# Altium schematic sheet scheme.SchDoc
size A2; FORM_Developer: Фамилия; FORM_Name: Название; FORM_Des: Обозначение; FORM_Ctrl: Фамилия; FORM_Tctrl: Фамилия; FORM_Nctrl: Фамилия; FORM_State: Фамилия
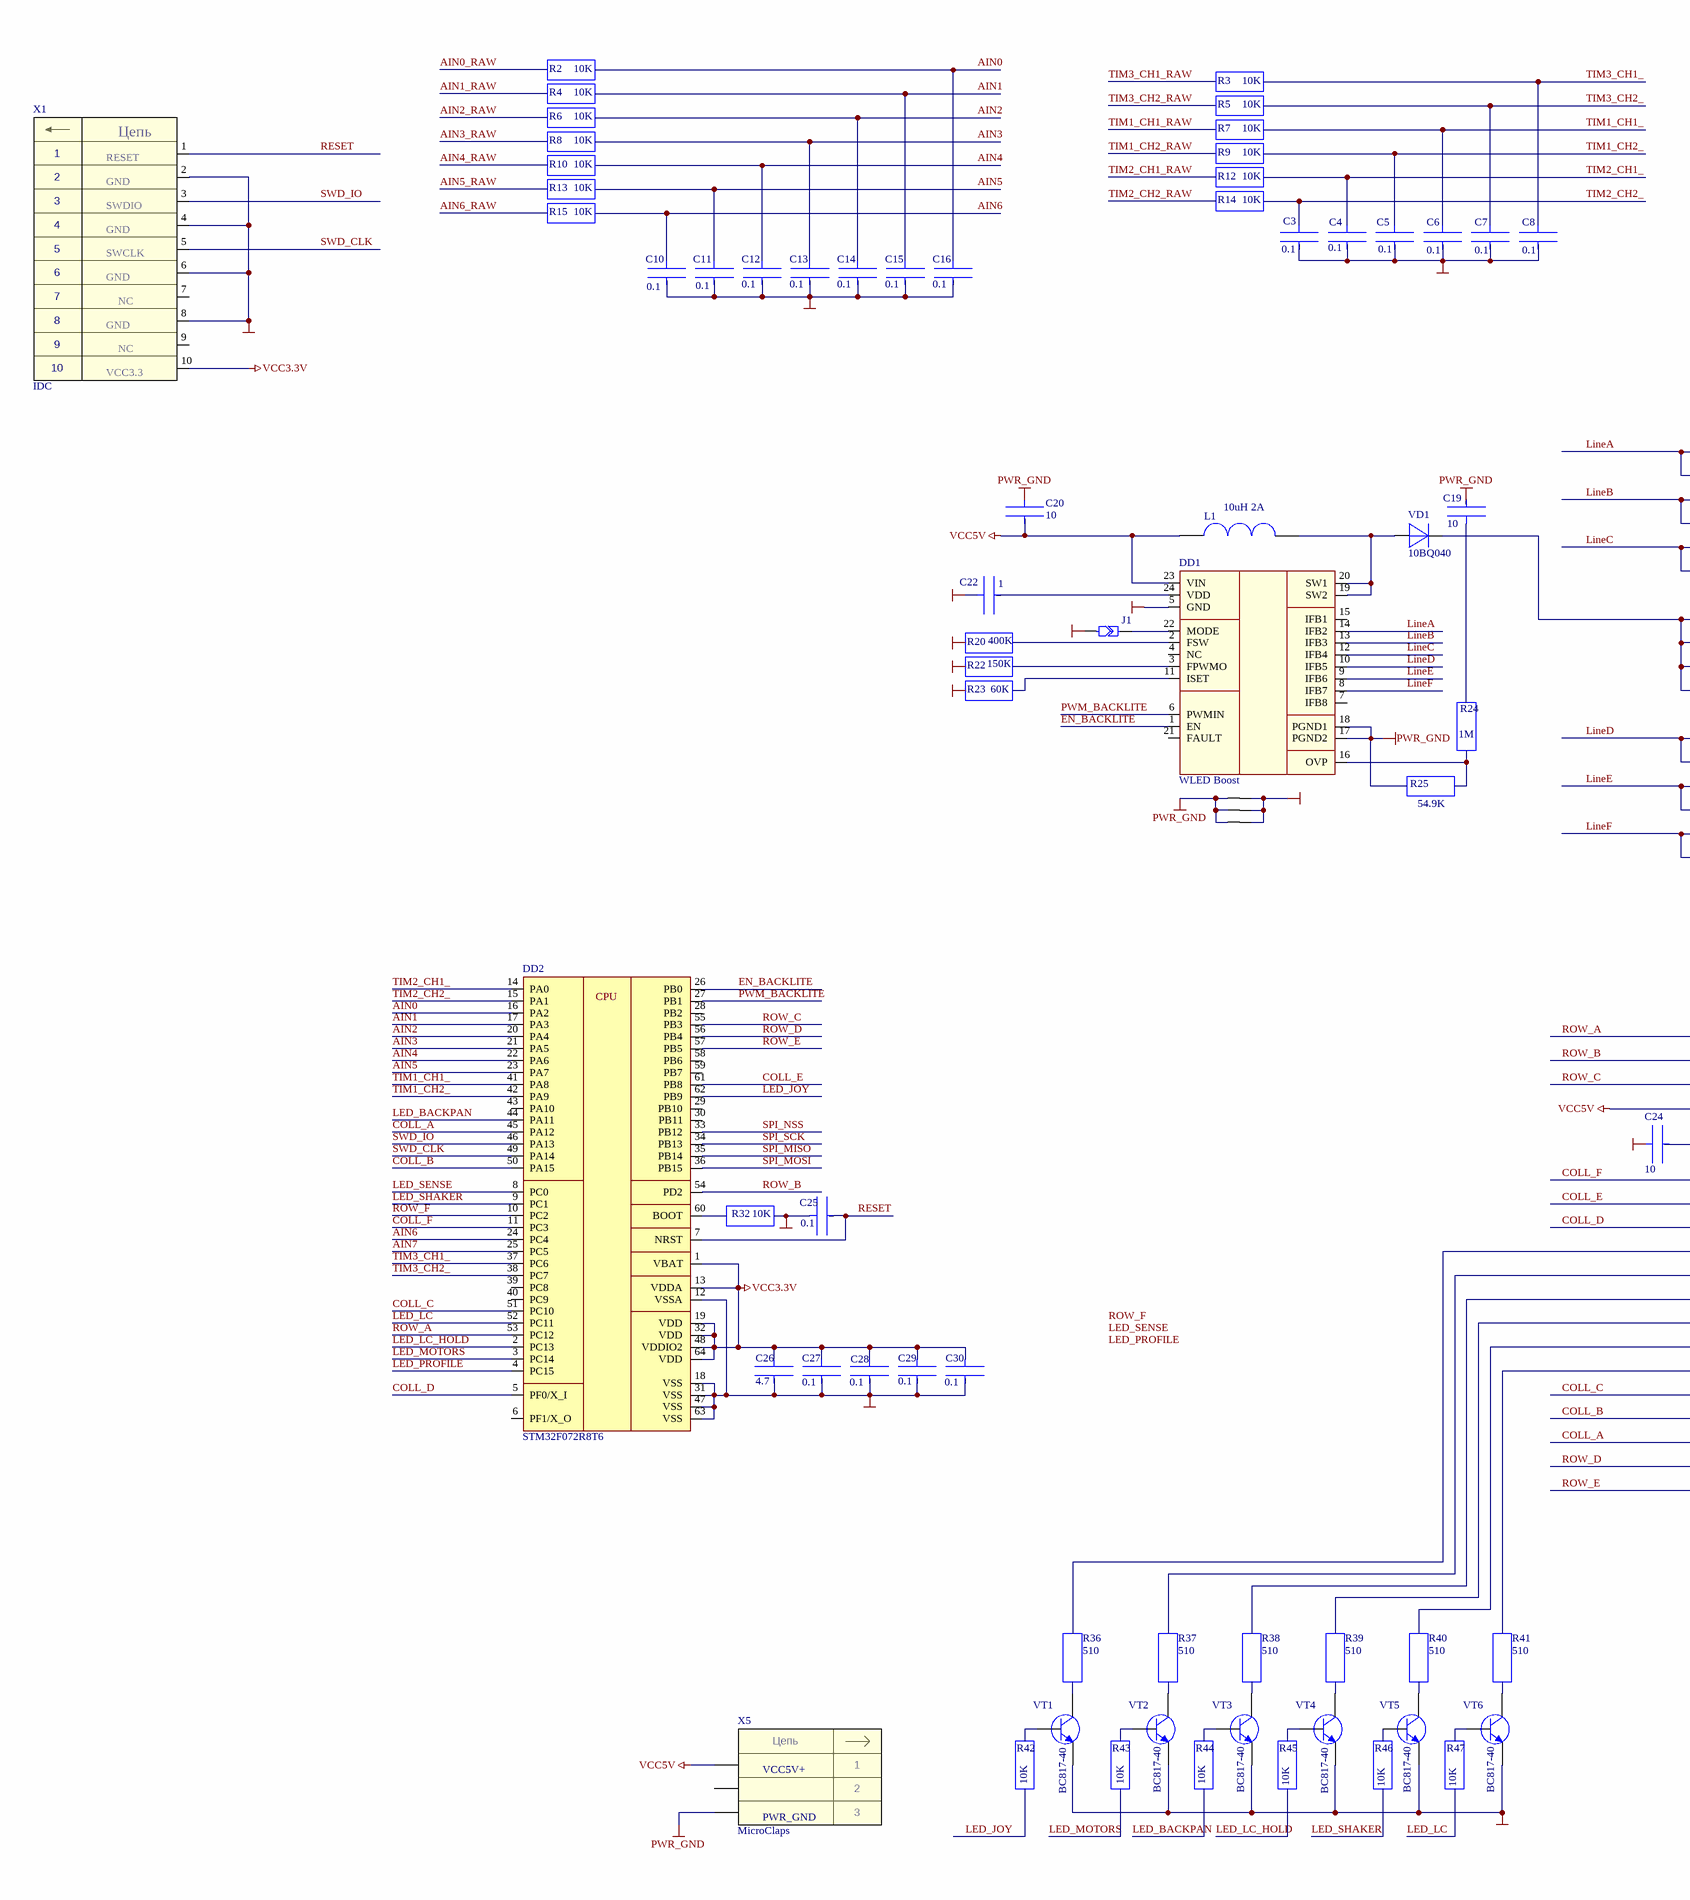
[diagram p0: scheme.SchDoc, left]
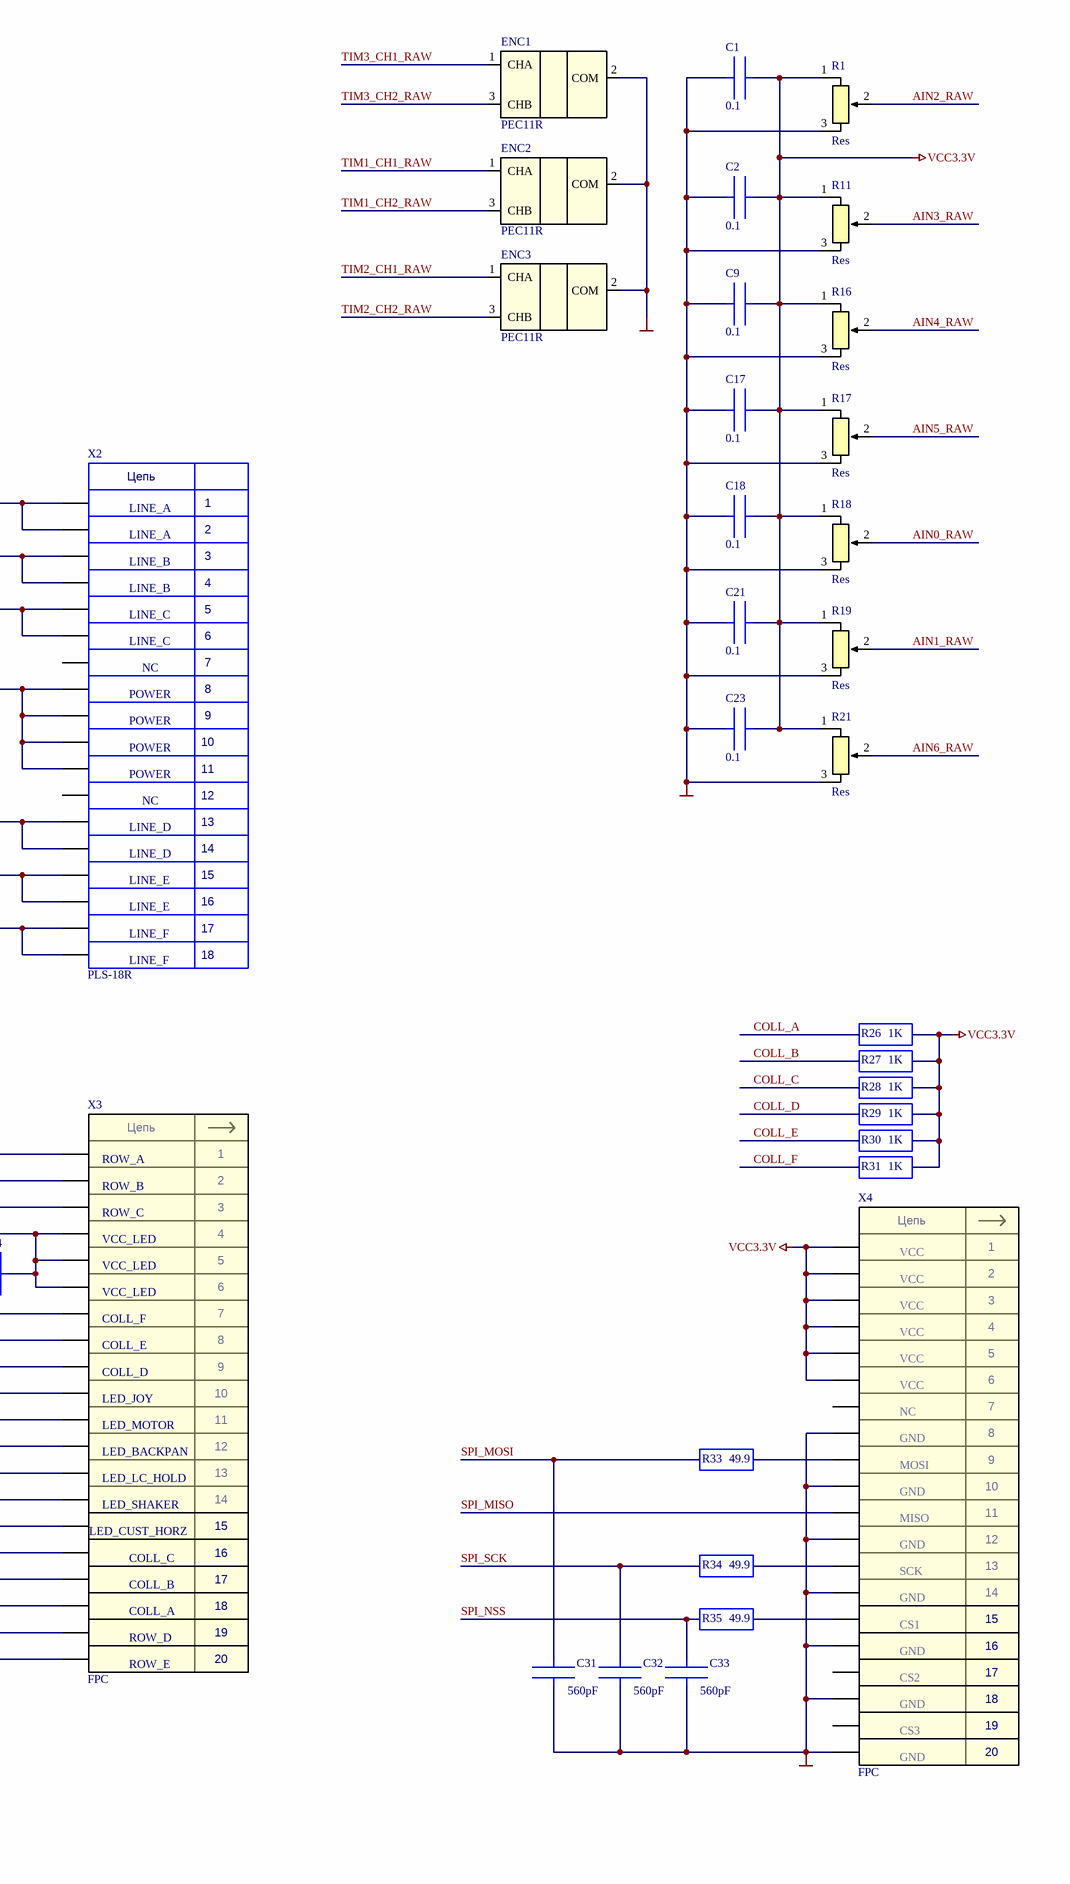
[diagram p1: scheme.SchDoc, right]

## Parts
1  Wire Bridge  [Bridge 1.2mm]  (value not drawn)  (net tie, no BOM)
2  Wire Bridge  [Bridge 1.2mm]  (value not drawn)  (net tie, no BOM)
3  Wire Bridge  [Bridge 1.2mm]  (value not drawn)  (net tie, no BOM)
C1  value 0.1  [C0402]  (hidden comment: Cap)
C2  value 0.1  [C0402]  (hidden comment: Cap)
C3  value 0.1  [C0402]  (hidden comment: Cap)
C4  value 0.1  [C0402]  (hidden comment: Cap)
C5  value 0.1  [C0402]  (hidden comment: Cap)
C6  value 0.1  [C0402]  (hidden comment: Cap)
C7  value 0.1  [C0402]  (hidden comment: Cap)
C8  value 0.1  [C0402]  (hidden comment: Cap)
C9  value 0.1  [C0402]  (hidden comment: Cap)
C10  value 0.1  [C0402]  (hidden comment: Cap)
C11  value 0.1  [C0402]  (hidden comment: Cap)
C12  value 0.1  [C0402]  (hidden comment: Cap)
C13  value 0.1  [C0402]  (hidden comment: Cap)
C14  value 0.1  [C0402]  (hidden comment: Cap)
C15  value 0.1  [C0402]  (hidden comment: Cap)
C16  value 0.1  [C0402]  (hidden comment: Cap)
C17  value 0.1  [C0402]  (hidden comment: Cap)
C18  value 0.1  [C0402]  (hidden comment: Cap)
C19  value 10  [C1206]  (hidden comment: Cap)
C20  value 10  [C1206]  (hidden comment: Cap)
C21  value 0.1  [C0402]  (hidden comment: Cap)
C22  value 1  [C0603]  (hidden comment: Cap)
C23  value 0.1  [C0402]  (hidden comment: Cap)
C24  value 10  [C1206]  (hidden comment: Cap)
C25  value 0.1  [C0402]  (hidden comment: Cap)
C26  value 4.7  [C0402]  (hidden comment: Cap)
C27  value 0.1  [C0402]  (hidden comment: Cap)
C28  value 0.1  [C0402]  (hidden comment: Cap)
C29  value 0.1  [C0402]  (hidden comment: Cap)
C30  value 0.1  [C0402]  (hidden comment: Cap)
C31  value 560pF  [C0402]  (hidden comment: Cap)
C32  value 560pF  [C0402]  (hidden comment: Cap)
C33  value 560pF  [C0402]  (hidden comment: Cap)
DD1  WLED Boost  [WQFN-24]
DD2  Type: STM32F072R8T6  [LQFP64_M]  (hidden comment: STM32F072Rx)
ENC1  PEC11R  [PEC11R]
ENC2  PEC11R  [PEC11R]
ENC3  PEC11R  [PEC11R]
J1  JumperB  [SM/JUMPER_SHORT]  (value not drawn)  (no BOM)
L1  value 10uH 2A  [SDR0805]  (hidden comment: IND2)
R1  Res  [P16NP_16mm]
R2  value 10K  [R0402]  (hidden comment: Res)
R3  value 10K  [R0402]  (hidden comment: Res)
R4  value 10K  [R0402]  (hidden comment: Res)
R5  value 10K  [R0402]  (hidden comment: Res)
R6  value 10K  [R0402]  (hidden comment: Res)
R7  value 10K  [R0402]  (hidden comment: Res)
R8  value 10K  [R0402]  (hidden comment: Res)
R9  value 10K  [R0402]  (hidden comment: Res)
R10  value 10K  [R0402]  (hidden comment: Res)
R11  Res  [P16NP_16mm]
R12  value 10K  [R0402]  (hidden comment: Res)
R13  value 10K  [R0402]  (hidden comment: Res)
R14  value 10K  [R0402]  (hidden comment: Res)
R15  value 10K  [R0402]  (hidden comment: Res)
R16  Res  [P16NP_16mm]
R17  Res  [P16NP_16mm]
R18  Res  [P16NP_16mm]
R19  Res  [P16NP_16mm]
R20  value 400K  [R0402]  (hidden comment: Res)
R21  Res  [P16NP_16mm]
R22  value 150К  [R0402]  (hidden comment: Res)
R23  value 60К  [R0402]  (hidden comment: Res)
R24  value 1M  [R0603]  (hidden comment: Res)
R25  value 54.9K  [R0603]  (hidden comment: Res)
R26  value 1K  [R0402]  (hidden comment: Res)
R27  value 1K  [R0402]  (hidden comment: Res)
R28  value 1K  [R0402]  (hidden comment: Res)
R29  value 1K  [R0402]  (hidden comment: Res)
R30  value 1K  [R0402]  (hidden comment: Res)
R31  value 1K  [R0402]  (hidden comment: Res)
R32  value 10K  [R0402]  (hidden comment: Res)
R33  value 49.9  [R0402]  (hidden comment: Res)
R34  value 49.9  [R0402]  (hidden comment: Res)
R35  value 49.9  [R0402]  (hidden comment: Res)
R36  value 510  [R0402]  (hidden comment: Res)
R37  value 510  [R0402]  (hidden comment: Res)
R38  value 510  [R0402]  (hidden comment: Res)
R39  value 510  [R0402]  (hidden comment: Res)
R40  value 510  [R0402]  (hidden comment: Res)
R41  value 510  [R0402]  (hidden comment: Res)
R42  value 10K  [R0402]  (hidden comment: Res)
R43  value 10K  [R0402]  (hidden comment: Res)
R44  value 10K  [R0402]  (hidden comment: Res)
R45  value 10K  [R0402]  (hidden comment: Res)
R46  value 10K  [R0402]  (hidden comment: Res)
R47  value 10K  [R0402]  (hidden comment: Res)
VD1  Type: 10BQ040  [DI-SMB]  (hidden comment: Diode)
VT1  Type: BC817-40  [SOT23-3L]  (hidden comment: Transistor NPN)
VT2  Type: BC817-40  [SOT23-3L]  (hidden comment: Transistor NPN)
VT3  Type: BC817-40  [SOT23-3L]  (hidden comment: Transistor NPN)
VT4  Type: BC817-40  [SOT23-3L]  (hidden comment: Transistor NPN)
VT5  Type: BC817-40  [SOT23-3L]  (hidden comment: Transistor NPN)
VT6  Type: BC817-40  [SOT23-3L]  (hidden comment: Transistor NPN)
X1  IDC  [IDC2-10MS-SMD]
X2  18-pin Out  [PLS-18R]  (value not drawn)
X3  FPC  [FPC-20 TE 2-84953-0]
X4  FPC  [FPC-20 TE 2-1734592-0]
X5  MicroClaps  [MicroClaspSingle - 3Pin]

## Nets
GND: 1.2 2.2 3.2 C1.1 C2.1 C3.2 C4.2 C5.2 C6.2 C7.2 C8.2 C9.1 C10.2 C11.2 C12.2 C13.2 C14.2 C15.2 C16.2 C17.1 C18.1 C21.1 C22.1 C23.1 C24.1 C25.1 C26.2 C27.2 C28.2 C29.2 C30.2 C31.2 C32.2 C33.2 DD1.5(GND) DD2.12(VSSA) DD2.18(VSS) DD2.31(VSS) DD2.47(VSS) DD2.63(VSS) ENC1.2(COM) ENC2.2(COM) ENC3.2(COM) J1.1 R1.3 R11.3 R16.3 R17.3 R18.3 R19.3 R20.1 R21.3 R22.1 R23.1 R32.2 VT1.2(E) VT2.2(E) VT3.2(E) VT4.2(E) VT5.2(E) VT6.2(E) X1.2 X1.4 X1.6 X1.8 X4.8(XXX) X4.10(XXX) X4.12(XXX) X4.14(XXX) X4.16(XXX) X4.18(XXX) X4.20(XXX)
PWR_GND: 1.1 2.1 3.1 C19.2 C20.1 DD1.17(PGND2) DD1.18(PGND1) R25.2 X5.3(XXX)
VCC3.3V: C1.2 C2.2 C9.2 C17.2 C18.2 C21.2 C23.2 C26.1 C27.1 C28.1 C29.1 C30.1 DD2.1(VBAT) DD2.13(VDDA) DD2.19(VDD) DD2.32(VDD) DD2.48(VDDIO2) DD2.64(VDD) R1.1 R11.1 R16.1 R17.1 R18.1 R19.1 R21.1 R26.2 R27.2 R28.2 R29.2 R30.2 R31.2 X1.10 X4.1(XXX) X4.2(XXX) X4.3(XXX) X4.4(XXX) X4.5(XXX) X4.6(XXX)
VCC5V: C20.2 C24.2 DD1.23(VIN) L1.1 X3.4(XXX) X3.5(XXX) X3.6(XXX) X5.1(XXX)
AIN0: C16.1 DD2.16(PA2) R2.2
AIN0_RAW: R2.1 R18.2
AIN1: C15.1 DD2.17(PA3) R4.2
AIN1_RAW: R4.1 R19.2
AIN2: C14.1 DD2.20(PA4) R6.2
AIN2_RAW: R1.2 R6.1
AIN3: C13.1 DD2.21(PA5) R8.2
AIN3_RAW: R8.1 R11.2
AIN4: C12.1 DD2.22(PA6) R10.2
AIN4_RAW: R10.1 R16.2
AIN5: C11.1 DD2.23(PA7) R13.2
AIN5_RAW: R13.1 R17.2
AIN6: C10.1 DD2.24(PC4) R15.2
AIN6_RAW: R15.1 R21.2
AIN7: DD2.25(PC5)
COLL_A: DD2.45(PA12) R26.1 X3.18(XXX)
COLL_B: DD2.50(PA15) R27.1 X3.17(XXX)
COLL_C: DD2.51(PC10) R28.1 X3.16(XXX)
COLL_D: DD2.5(PF0/X_I) R29.1 X3.9(XXX)
COLL_E: DD2.61(PB8) R30.1 X3.8(XXX)
COLL_F: DD2.11(PC3) R31.1 X3.7(XXX)
EN_BACKLITE: DD1.1(EN) DD2.26(PB0)
LED_BACKPAN: DD2.44(PA11) R44.1
LED_JOY: DD2.62(PB9) R42.1
LED_LC: DD2.52(PC11) R47.1
LED_LC_HOLD: DD2.2(PC13) R45.1
LED_MOTORS: DD2.3(PC14) R43.1
LED_PROFILE: DD2.4(PC15)
LED_SENSE: DD2.8(PC0)
LED_SHAKER: DD2.9(PC1) R46.1
LineA: DD1.14(IFB2) X2.1(XXX) X2.2(XXX)
LineB: DD1.13(IFB3) X2.3(XXX) X2.4(XXX)
LineC: DD1.12(IFB4) X2.5(XXX) X2.6(XXX)
LineD: DD1.10(IFB5) X2.13(XXX) X2.14(XXX)
LineE: DD1.9(IFB6) X2.15(XXX) X2.16(XXX)
LineF: DD1.8(IFB7) X2.17(XXX) X2.18(XXX)
PWM_BACKLITE: DD1.6(PWMIN) DD2.27(PB1)
RESET: C25.2 DD2.7(NRST) X1.1
ROW_A: DD2.53(PC12) X3.1(XXX)
ROW_B: DD2.54(PD2) X3.2(XXX)
ROW_C: DD2.55(PB3) X3.3(XXX)
ROW_D: DD2.56(PB4) X3.19(XXX)
ROW_E: DD2.57(PB5) X3.20(XXX)
ROW_F: DD2.10(PC2)
SPI_MISO: DD2.35(PB14) X4.11(XXX)
SPI_MOSI: C31.1 DD2.36(PB15) R33.1
SPI_NSS: C33.1 DD2.33(PB12) R35.1
SPI_SCK: C32.1 DD2.34(PB13) R34.1
SWD_CLK: DD2.49(PA14) X1.5
SWD_IO: DD2.46(PA13) X1.3
TIM1_CH1_: C6.1 DD2.41(PA8) R7.2
TIM1_CH1_RAW: ENC2.1(CHA) R7.1
TIM1_CH2_: C5.1 DD2.42(PA9) R9.2
TIM1_CH2_RAW: ENC2.3(CHB) R9.1
TIM2_CH1_: C4.1 DD2.14(PA0) R12.2
TIM2_CH1_RAW: ENC3.1(CHA) R12.1
TIM2_CH2_: C3.1 DD2.15(PA1) R14.2
TIM2_CH2_RAW: ENC3.3(CHB) R14.1
TIM3_CH1_: C8.1 DD2.37(PC6) R3.2
TIM3_CH1_RAW: ENC1.1(CHA) R3.1
TIM3_CH2_: C7.1 DD2.38(PC7) R5.2
TIM3_CH2_RAW: ENC1.3(CHB) R5.1
NetC19_1: C19.1 R24.2
NetC22_2: C22.2 DD1.24(VDD)
NetDD1_2: DD1.2(FSW) R20.2
NetDD1_3: DD1.3(FPWMO) R22.2
NetDD1_11: DD1.11(ISET) R23.2
NetDD1_16: DD1.16(OVP) R24.1 R25.1
NetDD1_19: DD1.19(SW2) DD1.20(SW1) L1.2 VD1.1(anode)
NetDD1_22: DD1.22(MODE) J1.2
NetDD2_60: DD2.60(BOOT) R32.1
NetR33_2: R33.2 X4.9(XXX)
NetR34_2: R34.2 X4.13(XXX)
NetR35_2: R35.2 X4.15(XXX)
NetR36_1: R36.1 VT1.3(C)
NetR36_2: R36.2 X3.10(XXX)
NetR37_1: R37.1 VT2.3(C)
NetR37_2: R37.2 X3.11(XXX)
NetR38_1: R38.1 VT3.3(C)
NetR38_2: R38.2 X3.12(XXX)
NetR39_1: R39.1 VT4.3(C)
NetR39_2: R39.2 X3.13(XXX)
NetR40_1: R40.1 VT5.3(C)
NetR40_2: R40.2 X3.14(XXX)
NetR41_1: R41.1 VT6.3(C)
NetR41_2: R41.2 X3.15(XXX)
NetR42_2: R42.2 VT1.1(B)
NetR43_2: R43.2 VT2.1(B)
NetR44_2: R44.2 VT3.1(B)
NetR45_2: R45.2 VT4.1(B)
NetR46_2: R46.2 VT5.1(B)
NetR47_2: R47.2 VT6.1(B)
NetVD1_2: VD1.2(cathode) X2.8(XXX) X2.9(XXX) X2.10(XXX) X2.11(XXX)

Not connected (* = marked no-connect by the designer): DD1 4(NC) 7(IFB8) 15(IFB1) 21(FAULT); DD2 6(PF1/X_O) 28(PB2) 29(PB10) 30(PB11) 39(PC8) 40(PC9) 43(PA10) 58(PB6) 59(PB7); X1 7 9; X2 7(XXX) 12(XXX); X4 7(XXX) 17(XXX) 19(XXX); X5 2(XXX)

## Notes on the sheet
- (near X1) RESET
- GND
- (near X1) SWDIO
- (near X1) SWCLK
- NC
- (near X1) VCC3.3
- (near X2) LINE_A
- (near X2) LINE_B
- (near X2) LINE_C
- (near X2) POWER
- (near X2) NC
- (near X2) LINE_D
- (near X2) LINE_E
- (near X2) LINE_F
- (near X3) ROW_A
- (near X3) ROW_B
- (near X3) ROW_C
- (near X3) VCC_LED
- (near X4) VCC
- (near X3) COLL_F
- (near X3) COLL_D
- (near X3) COLL_E
- (near X3) LED_JOY
- (near X3) LED_BACKPAN
- (near X3) LED_MOTOR
- (near X4) GND
- (near X4) NC
- (near X3) LED_SHAKER
- (near X3) LED_LC_HOLD
- (near X4) MOSI
- (near X4) MISO
- (near X3) LED_CUST_HORZ
- (near X3) COLL_B
- (near X3) COLL_C
- (near X4) SCK
- (near X3) COLL_A
- (near X3) ROW_D
- (near X4) CS1
- (near X3) ROW_E
- (near X4) CS2
- (near X4) CS3
- (near X5) VCC5V+
- (near X5) PWR_GND
- Labels drawn without touching a wire or pin: LED_PROFILE, LED_SENSE, ROW_F
- Подп. и дата
- Инв. № дубл.
- Взам. инв. №
- Разраб.
- Изм.
- Лист
- № докум.
- Подп.
- Дата
- Лит.
- Масса
- Масшт.
- Пров.
- Т. контр.
- Схема электрическая принципиальная
- Листов
- Инв. № подп.
- Н. контр.
- Утв.
- (in symbol 18-pin Out) Цепь
- (in symbol FPC-20pin 0.5mm) Цепь
- (in symbol FPC-20pin 1mm) Цепь
- (in symbol IDC2-10) Цепь
- (in symbol MicroClapsSingle-3) Цепь
- (in symbol STM32F072Rx) CPU

## Library data of the parts
C1-C18 C21 C23 C25 C27-C33 = Cap: Capacitor; Voltage: 16
C19 C20 C24 = Cap: Capacitor; Voltage: 25
C22 C26 = Cap: Capacitor; Voltage: 6.3
DD1 = TPS61185: FP: WQFN-24; Type: NU
DD2 = STM32F072Rx: STM32 ARM-based 32-bit MCU, up to 128 KB Flash, crystal-less USB  FS 2.0, CAN, 12 timers, ADC, DAC & comm. interfaces, 2.0 - 3.6 V; FP: LQFP64
ENC1-ENC3 = PEC11R ENCODER: ENCODER
J1 = JumperB: Jumper on Board
L1 = IND2: Inductor
R1 R11 R16-R19 R21 = P16A Res: Potenciometr
R2-R10 R12-R15 R20 R22-R47 = Res: Resistor; Type: *; Precision: *
VD1 = Diode: FP: SMB
VT1-VT6 = Trans NPN: NPN transistor; FP: SOT-23-3
X1 = IDC2-10: IDC 2mm 10 pin
X2 = 18-pin Out: 18-pin Out Connector; Type: PLS-18R
X3 = FPC-20pin 1mm: FPC 20pin 1mm
X4 = FPC-20pin 0.5mm: FPC 20pin 0.5mm; Type: 2-1734592-0
X5 = MicroClapsSingle-3: MicroClapsConnector 3Pin SingleLine